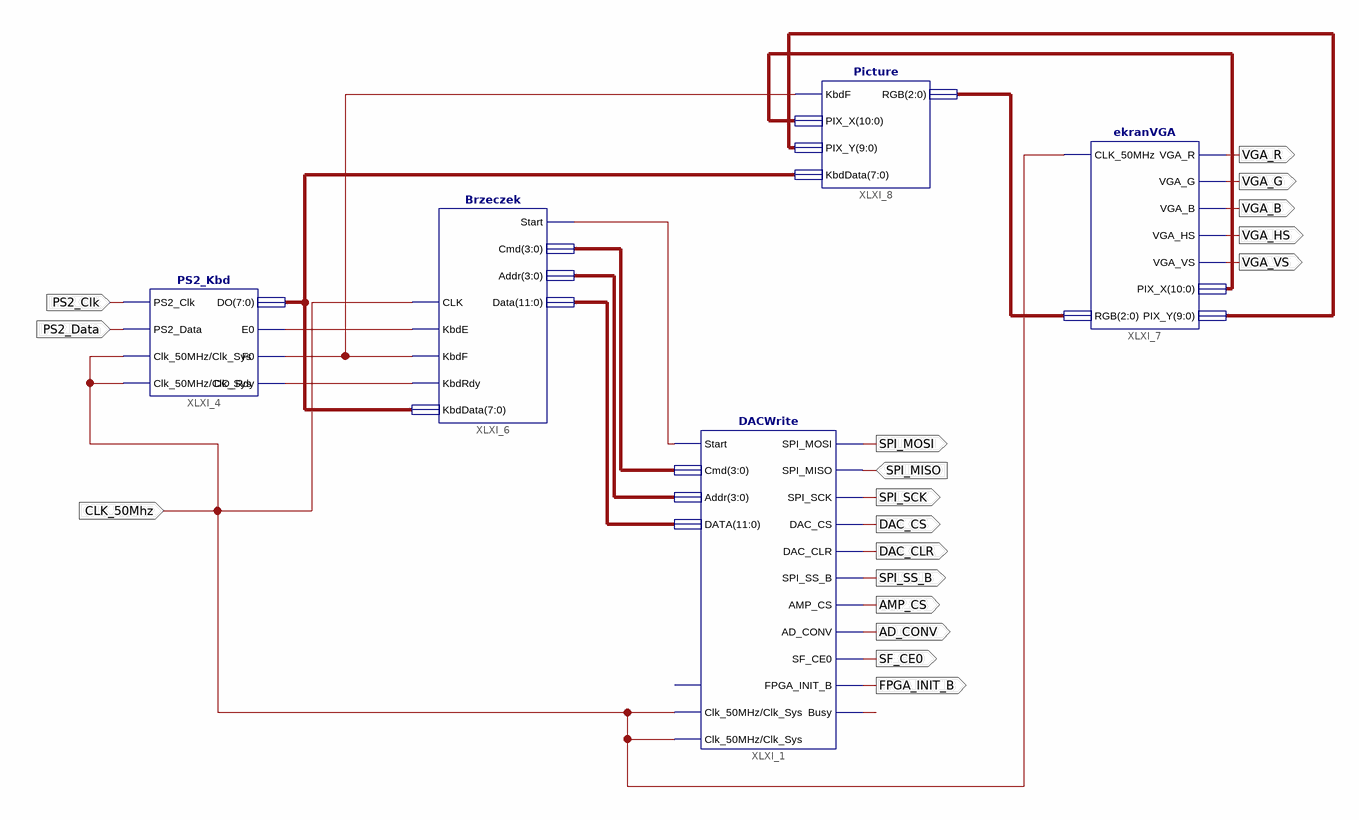
[diagram p0: schematic sheet 1]
// Xilinx ISE schematic sch.sch (spartan3e) as structural Verilog: 5 symbols, 18 ports
module sch (
  input  CLK_50Mhz,
  input  SPI_MISO,
  input  PS2_Clk,
  input  PS2_Data,
  output SPI_MOSI,
  output SPI_SCK,
  output DAC_CS,
  output DAC_CLR,
  output SPI_SS_B,
  output AMP_CS,
  output AD_CONV,
  output SF_CE0,
  output FPGA_INIT_B,
  output VGA_R,
  output VGA_G,
  output VGA_B,
  output VGA_HS,
  output VGA_VS
);

  wire XLXN_1, XLXN_19, XLXN_28, XLXN_30, XLXN_42;
  wire [2:0] XLXN_40;
  wire [3:0] XLXN_2, XLXN_3;
  wire [7:0] XLXN_27;
  wire [9:0] XLXN_39;
  wire [10:0] XLXN_38;
  wire [11:0] XLXN_4;

  DACWrite XLXI_1 (
    .Start(XLXN_1), .SPI_MISO(SPI_MISO), .Cmd(XLXN_2), .Addr(XLXN_3), .DATA(XLXN_4), .DAC_CLR(DAC_CLR),
    .DAC_CS(DAC_CS), .SPI_MOSI(SPI_MOSI), .SPI_SCK(SPI_SCK), .SPI_SS_B(SPI_SS_B), .AMP_CS(AMP_CS),
    .AD_CONV(AD_CONV), .SF_CE0(SF_CE0), .FPGA_INIT_B(FPGA_INIT_B), .Busy(XLXN_19), .Clk_50MHz(CLK_50Mhz),
    .Clk_Sys(CLK_50Mhz));  // open: Reset
  PS2_Kbd XLXI_4 (
    .PS2_Clk(PS2_Clk), .PS2_Data(PS2_Data), .Clk_50MHz(CLK_50Mhz), .E0(XLXN_28), .F0(XLXN_42),
    .DO_Rdy(XLXN_30), .DO(XLXN_27), .Clk_Sys(CLK_50Mhz));
  Brzeczek XLXI_6 (
    .KbdE(XLXN_28), .KbdF(XLXN_42), .KbdRdy(XLXN_30), .CLK(CLK_50Mhz), .KbdData(XLXN_27), .Start(XLXN_1),
    .Cmd(XLXN_2), .Addr(XLXN_3), .Data(XLXN_4));
  ekranVGA XLXI_7 (
    .CLK_50MHz(CLK_50Mhz), .RGB(XLXN_40), .VGA_R(VGA_R), .VGA_G(VGA_G), .VGA_B(VGA_B), .VGA_HS(VGA_HS),
    .VGA_VS(VGA_VS), .PIX_X(XLXN_38), .PIX_Y(XLXN_39));
  Picture XLXI_8 (.KbdF(XLXN_42), .PIX_X(XLXN_38), .PIX_Y(XLXN_39), .KbdData(XLXN_27), .RGB(XLXN_40));
endmodule
